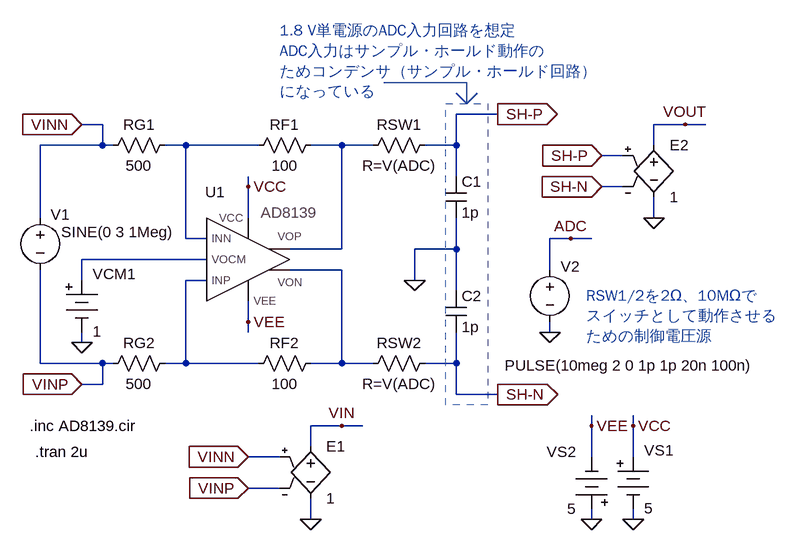
[diagram p0: schematic fig-02-05-24.asc]
fig-02-05-24.asc, the LTspice schematic file:
Version 4
SHEET 1 1332 1000
WIRE 640 -176 576 -176
WIRE 32 -160 0 -160
WIRE 928 -160 880 -160
WIRE 960 -160 928 -160
WIRE 32 -128 32 -160
WIRE 32 -128 -64 -128
WIRE 48 -128 32 -128
WIRE 160 -128 128 -128
WIRE 272 -128 160 -128
WIRE 400 -128 352 -128
WIRE 448 -128 400 -128
WIRE 576 -128 576 -176
WIRE 576 -128 528 -128
WIRE 880 -128 880 -160
WIRE 832 -112 800 -112
WIRE 576 -80 576 -128
WIRE 256 -64 256 -80
WIRE 832 -64 800 -64
WIRE -64 -16 -64 -128
WIRE 256 -16 256 -64
WIRE 880 -16 880 -48
WIRE 160 16 160 -128
WIRE 192 16 160 16
WIRE 752 16 720 16
WIRE 784 16 752 16
WIRE 400 32 400 -128
WIRE 400 32 320 32
WIRE 576 32 576 -16
WIRE 576 32 512 32
WIRE 192 48 0 48
WIRE 400 64 320 64
WIRE 720 64 720 16
WIRE 0 80 0 48
WIRE 192 80 160 80
WIRE 512 80 512 32
WIRE 576 96 576 32
WIRE 256 144 256 112
WIRE 256 160 256 144
WIRE 720 160 720 144
WIRE 0 176 0 160
WIRE -64 208 -64 64
WIRE 32 208 -64 208
WIRE 48 208 32 208
WIRE 160 208 160 80
WIRE 160 208 128 208
WIRE 272 208 160 208
WIRE 400 208 400 64
WIRE 400 208 352 208
WIRE 448 208 400 208
WIRE 576 208 576 160
WIRE 576 208 528 208
WIRE 32 240 32 208
WIRE 32 240 0 240
WIRE 576 256 576 208
WIRE 640 256 576 256
WIRE 400 304 352 304
WIRE 432 304 400 304
WIRE 784 304 784 288
WIRE 848 304 848 288
WIRE 352 336 352 304
WIRE 304 352 256 352
WIRE 784 352 784 304
WIRE 848 352 848 304
WIRE 304 400 256 400
WIRE 352 448 352 416
WIRE 784 448 784 432
WIRE 848 448 848 432
FLAG 640 -176 SH-P
IOPIN 640 -176 Out
FLAG 784 448 0
FLAG 848 448 0
FLAG 784 304 VEE
FLAG 848 304 VCC
FLAG 256 -64 VCC
FLAG 256 144 VEE
FLAG 640 256 SH-N
IOPIN 640 256 Out
FLAG 0 -160 VINN
IOPIN 0 -160 In
FLAG 0 240 VINP
IOPIN 0 240 In
FLAG 880 -16 0
FLAG 352 448 0
FLAG 256 400 VINP
IOPIN 256 400 In
FLAG 256 352 VINN
IOPIN 256 352 In
FLAG 800 -64 SH-N
IOPIN 800 -64 In
FLAG 800 -112 SH-P
IOPIN 800 -112 In
FLAG 400 304 VIN
FLAG 928 -160 VOUT
FLAG 0 176 0
FLAG 512 80 0
FLAG 720 160 0
FLAG 752 16 ADC
SYMBOL res 368 -144 R90
WINDOW 0 0 56 VBottom 2
WINDOW 3 32 56 VTop 2
SYMATTR InstName RF1
SYMATTR Value 100
SYMBOL res 144 -144 R90
WINDOW 0 0 56 VBottom 2
WINDOW 3 32 56 VTop 2
SYMATTR InstName RG1
SYMATTR Value 500
SYMBOL voltage -64 -32 R0
WINDOW 0 31 26 Bottom 2
WINDOW 3 119 53 Bottom 2
WINDOW 123 35 89 Top 2
WINDOW 39 0 0 Left 0
SYMATTR InstName V1
SYMATTR Value SINE(0 3 1Meg)
SYMBOL Misc\\battery 848 336 R0
WINDOW 0 17 6 Left 2
WINDOW 3 17 95 Left 2
WINDOW 123 0 0 Left 0
WINDOW 39 0 0 Left 0
SYMATTR InstName VS1
SYMATTR Value 5
SYMBOL Misc\\battery 784 448 R180
WINDOW 0 24 104 Left 2
WINDOW 3 24 16 Left 2
WINDOW 123 0 0 Left 0
WINDOW 39 0 0 Left 0
SYMATTR InstName VS2
SYMATTR Value 5
SYMBOL AD8139-sub 256 48 R0
WINDOW 0 -51 -88 Bottom 2
SYMATTR InstName U1
SYMATTR Value AD8139
SYMATTR Prefix X
SYMBOL res 368 192 R90
WINDOW 0 0 56 VBottom 2
WINDOW 3 32 56 VTop 2
SYMATTR InstName RF2
SYMATTR Value 100
SYMBOL res 144 192 R90
WINDOW 0 0 56 VBottom 2
WINDOW 3 32 56 VTop 2
SYMATTR InstName RG2
SYMATTR Value 500
SYMBOL e 352 320 R0
SYMATTR InstName E1
SYMATTR Value 1
SYMBOL e 880 -144 R0
SYMATTR InstName E2
SYMATTR Value 1
SYMBOL Misc\\battery 0 64 R0
WINDOW 0 17 6 Left 2
WINDOW 3 17 95 Left 2
WINDOW 123 0 0 Left 0
WINDOW 39 0 0 Left 0
SYMATTR InstName VCM1
SYMATTR Value 1
SYMBOL cap 560 -80 R0
SYMATTR InstName C1
SYMATTR Value 1p
SYMBOL cap 560 96 R0
SYMATTR InstName C2
SYMATTR Value 1p
SYMBOL res 544 -144 R90
WINDOW 0 0 56 VBottom 2
WINDOW 3 32 56 VTop 2
SYMATTR InstName RSW1
SYMATTR Value R=V(ADC)
SYMBOL res 544 192 R90
WINDOW 0 0 56 VBottom 2
WINDOW 3 32 56 VTop 2
SYMATTR InstName RSW2
SYMATTR Value R=V(ADC)
SYMBOL voltage 720 48 R0
WINDOW 0 31 26 Bottom 2
WINDOW 3 123 179 Bottom 2
WINDOW 123 35 89 Top 2
WINDOW 39 0 0 Left 0
SYMATTR InstName V2
SYMATTR Value PULSE(10meg 2 0 1p 1p 20n 100n)
TEXT -80 304 Left 2 !.inc AD8139.cir
TEXT -72 344 Left 2 !.tran 2u
TEXT 304 -304 Left 2 ;1.8 V単電源のADC入力回路を想定\nADC入力はサンプル・ホールド動作の\nためコンデンサ（サンプル・ホールド回路）\nになっている
TEXT 776 104 Left 2 ;RSW1/2を2Ω、10MΩで\nスイッチとして動作させる\nための制御電圧源
LINE Normal 592 -224 464 -224
LINE Normal 592 -192 592 -224
LINE Normal 576 -208 592 -192
LINE Normal 608 -208 592 -192
RECTANGLE Normal 624 272 560 -192 2

The netlist it stands for:
* fig-02-05-24.asc
RF1 N002 N001 100
RG1 N001 VINN 500
V1 VINN VINP SINE(0 3 1Meg)
VS1 VCC 0 5
VS2 0 VEE 5
XU1 N001 N003 VCC N002 N004 VEE N005 AD8139-sub params: AD8139  ; pins INN VOCM VCC VOP VON VEE INP
RF2 N004 N005 100
RG2 N005 VINP 500
E1 VIN 0 VINN VINP 1
E2 VOUT 0 SH-P SH-N 1
VCM1 N003 0 1
C1 SH-P 0 1p
C2 0 SH-N 1p
RSW1 SH-P N002 R=V(ADC)
RSW2 SH-N N004 R=V(ADC)
V2 ADC 0 PULSE(10meg 2 0 1p 1p 20n 100n)
.inc AD8139.cir
.tran 2u
* 1.8 V単電源のADC入力回路を想定
* ADC入力はサンプル・ホールド動作の
* ためコンデンサ（サンプル・ホールド回路）
* になっている
* RSW1/2を2Ω、10MΩで
* スイッチとして動作させる
* ための制御電圧源
.backanno
.end